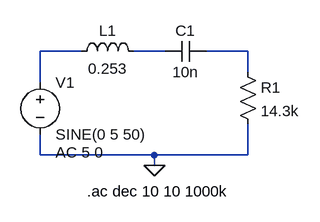
[diagram p0: schematic BandPass_RLC.asc]
BandPass_RLC.asc, the LTspice schematic file:
Version 4.1
SHEET 1 880 680
WIRE 96 64 32 64
WIRE 224 64 176 64
WIRE 352 64 288 64
WIRE 352 96 352 64
WIRE 32 112 32 64
WIRE 32 224 32 192
WIRE 208 224 32 224
WIRE 352 224 352 176
WIRE 352 224 208 224
WIRE 208 240 208 224
FLAG 208 240 0
SYMBOL voltage 32 96 R0
WINDOW 123 24 124 Left 2
WINDOW 39 0 0 Left 0
SYMATTR Value2 AC 5 0
SYMATTR InstName V1
SYMATTR Value SINE(0 5 50)
SYMBOL ind 80 80 R270
WINDOW 0 32 56 VTop 2
WINDOW 3 5 56 VBottom 2
SYMATTR InstName L1
SYMATTR Value 0.253
SYMATTR SpiceLine Rser=1m
SYMBOL cap 224 80 R270
WINDOW 0 32 32 VTop 2
WINDOW 3 0 32 VBottom 2
SYMATTR InstName C1
SYMATTR Value 10n
SYMBOL res 336 80 R0
SYMATTR InstName R1
SYMATTR Value 14.3k
TEXT 104 280 Left 2 !.ac dec 10 10 1000k

The netlist it stands for:
* BandPass_RLC.asc
V1 N001 0 SINE(0 5 50) AC 5 0
L1 N001 N002 0.253 Rser=1m
C1 N002 N003 10n
R1 N003 0 14.3k
.ac dec 10 10 1000k
.backanno
.end